# EAGLE schematic Rx_BEC_V2-1 (EAGLE 9.6.0)
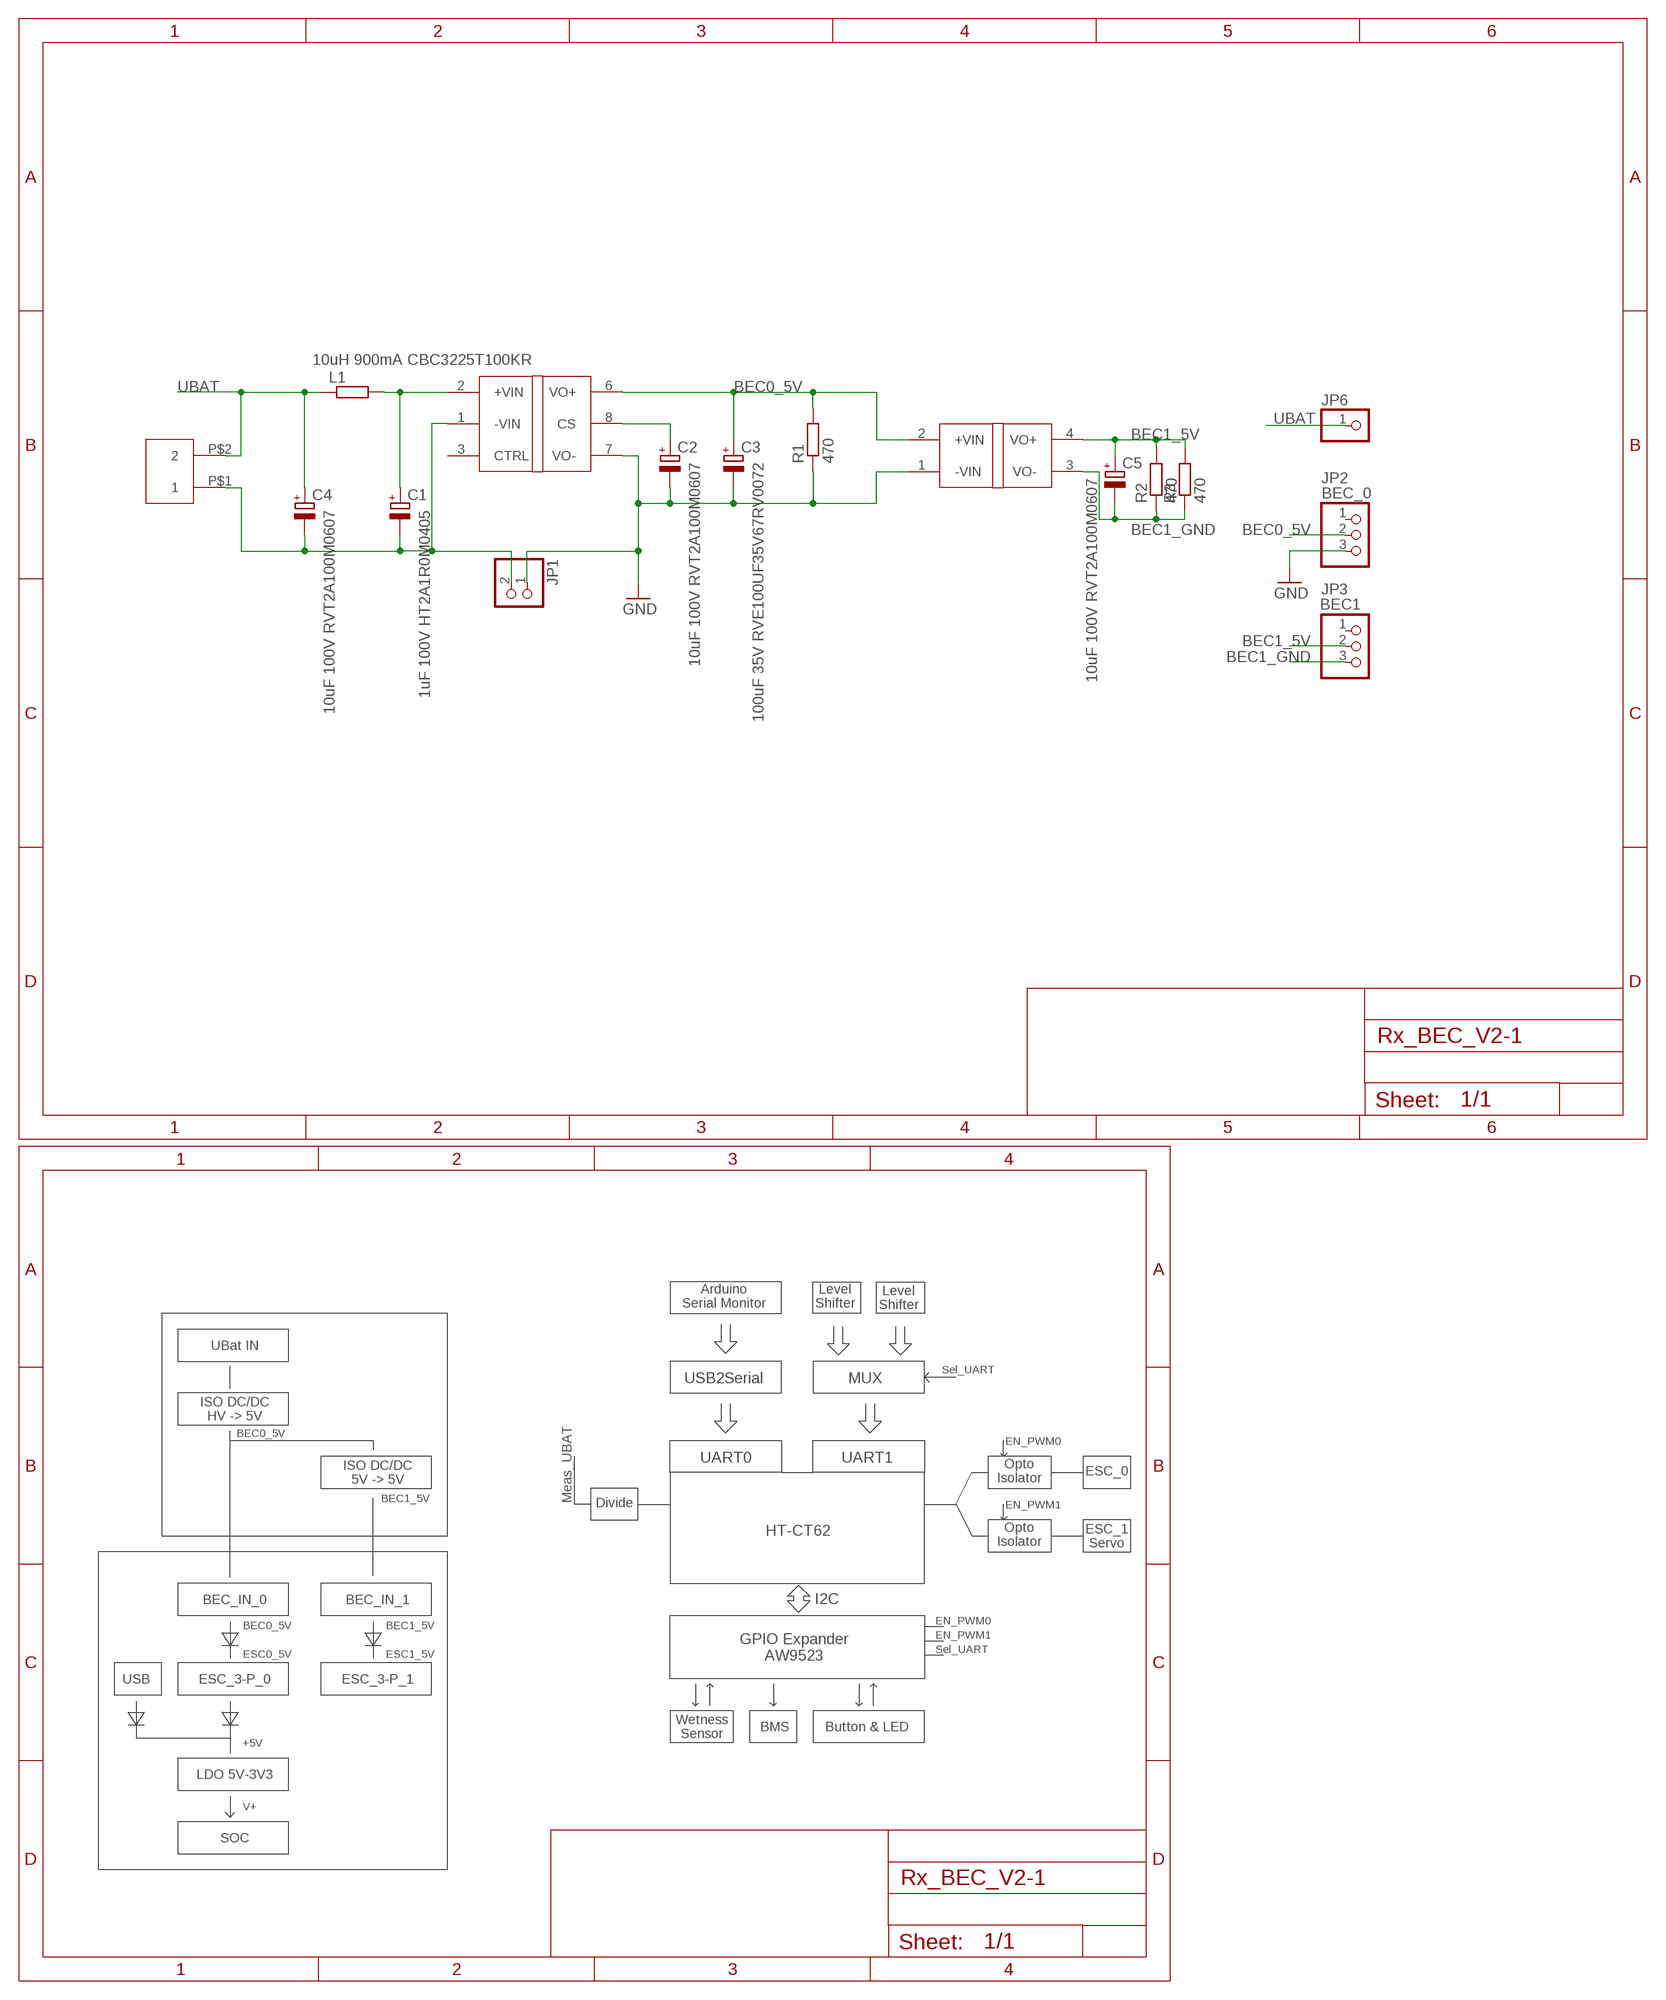
[diagram p0: schematic, sheet 1]

## Parts
C1  1uF 100V HT2A1R0M0405  CPOL-EU153CLV-0405  [153CLV-0405]
C2  10uF 100V RVT2A100M0607  CPOL-EU153CLV-0605  [153CLV-0605]
C3  100uF 35V RVE100UF35V67RV0072  CPOL-EU153CLV-0605  [153CLV-0605]
C4  10uF 100V RVT2A100M0607  CPOL-EU153CLV-0605  [153CLV-0605]
C5  10uF 100V RVT2A100M0607  CPOL-EU153CLV-0605  [153CLV-0605]
JP1  PINHD-1X2  [1X02]
JP2  BEC_0  PINHD-1X3  [1X03]
JP3  BEC1  PINHD-1X3  [1X03]
JP6  PINHD-1X1  [1X01]
L1  10uH 900mA CBC3225T100KR  R-EU_R1210  [R1210]
R1  470  R-EU_R0805  [R0805]
R2  470  R-EU_R0805  [R0805]
R3  470  R-EU_R0805  [R0805]
U$1  WJ126V-5.0-2P  [WJ126V-5.0-2P]
U$2  B0505S-1WR3  [B0505S-1WR3]
U$3  URB4805S-3WR3  [URB4805S-3WR3]

## Nets
BEC0_5V: C3.+ JP2.2 R1.2 U$2.2(+VIN) U$3.6(VO+)
BEC1_5V: C5.+ JP3.2 R2.2 R3.2 U$2.4(VO+)
BEC1_GND: C5.- JP3.3 R2.1 R3.1 U$2.3(VO-)
GND: C2.- C3.- JP1.1 JP2.3 R1.1 U$2.1(-VIN) U$3.7(VO-)
N$2: C1.+ L1.2 U$3.2(+VIN)
N$3: C1.- C4.- JP1.2 U$1.P$1 U$3.1(-VIN)
N$4: C2.+ U$3.8(CS)
UBAT: C4.+ JP6.1 L1.1 U$1.P$2
Unconnected: JP2.1 JP3.1 U$3.3(CTRL)

## Notes on the sheet
- Arduino
  Serial Monitor
- Level
  Shifter
- Level
  Shifter
- UBat IN
- Sel_UART
- USB2Serial | MUX
- ISO DC/DC
  HV -> 5V
- BEC0_5V
- EN_PWM0
- Meas_UBAT | UART0 | UART1
- Opto
  Isolator
- ESC_0
- ISO DC/DC
  5V -> 5V
- BEC1_5V | Divide
- EN_PWM1
- Opto
  Isolator
- HT-CT62
- ESC_1
  Servo
- BEC_IN_0 | BEC_IN_1
- I2C
- EN_PWM0
- BEC0_5V | BEC1_5V
- EN_PWM1
- GPIO Expander
  AW9523
- Sel_UART
- ESC0_5V | ESC1_5V
- USB | ESC_3-P_0 | ESC_3-P_1
- Wetness
  Sensor
- BMS | Button & LED
- +5V
- LDO 5V-3V3
- V+
- SOC

## Library data of the parts
C1-C5 = rcl:CPOL-EU: POLARIZED CAPACITOR, European symbol; SPICEPREFIX: C
JP1 = pinhead:PINHD-1X2: PIN HEADER
JP2 JP3 = pinhead:PINHD-1X3: PIN HEADER
JP6 = pinhead:PINHD-1X1: PIN HEADER
L1 R1-R3 = rcl:R-EU_: RESISTOR, European symbol; SPICEPREFIX: R
U$1 = WJ126V-5.0:WJ126V-5.0-2P
U$2 = DC-DC:B0505S-1WR3
U$3 = DC-DC:URB4805S-3WR3